# EAGLE design ParaBeep V0.35 (EAGLE 9.6.2)
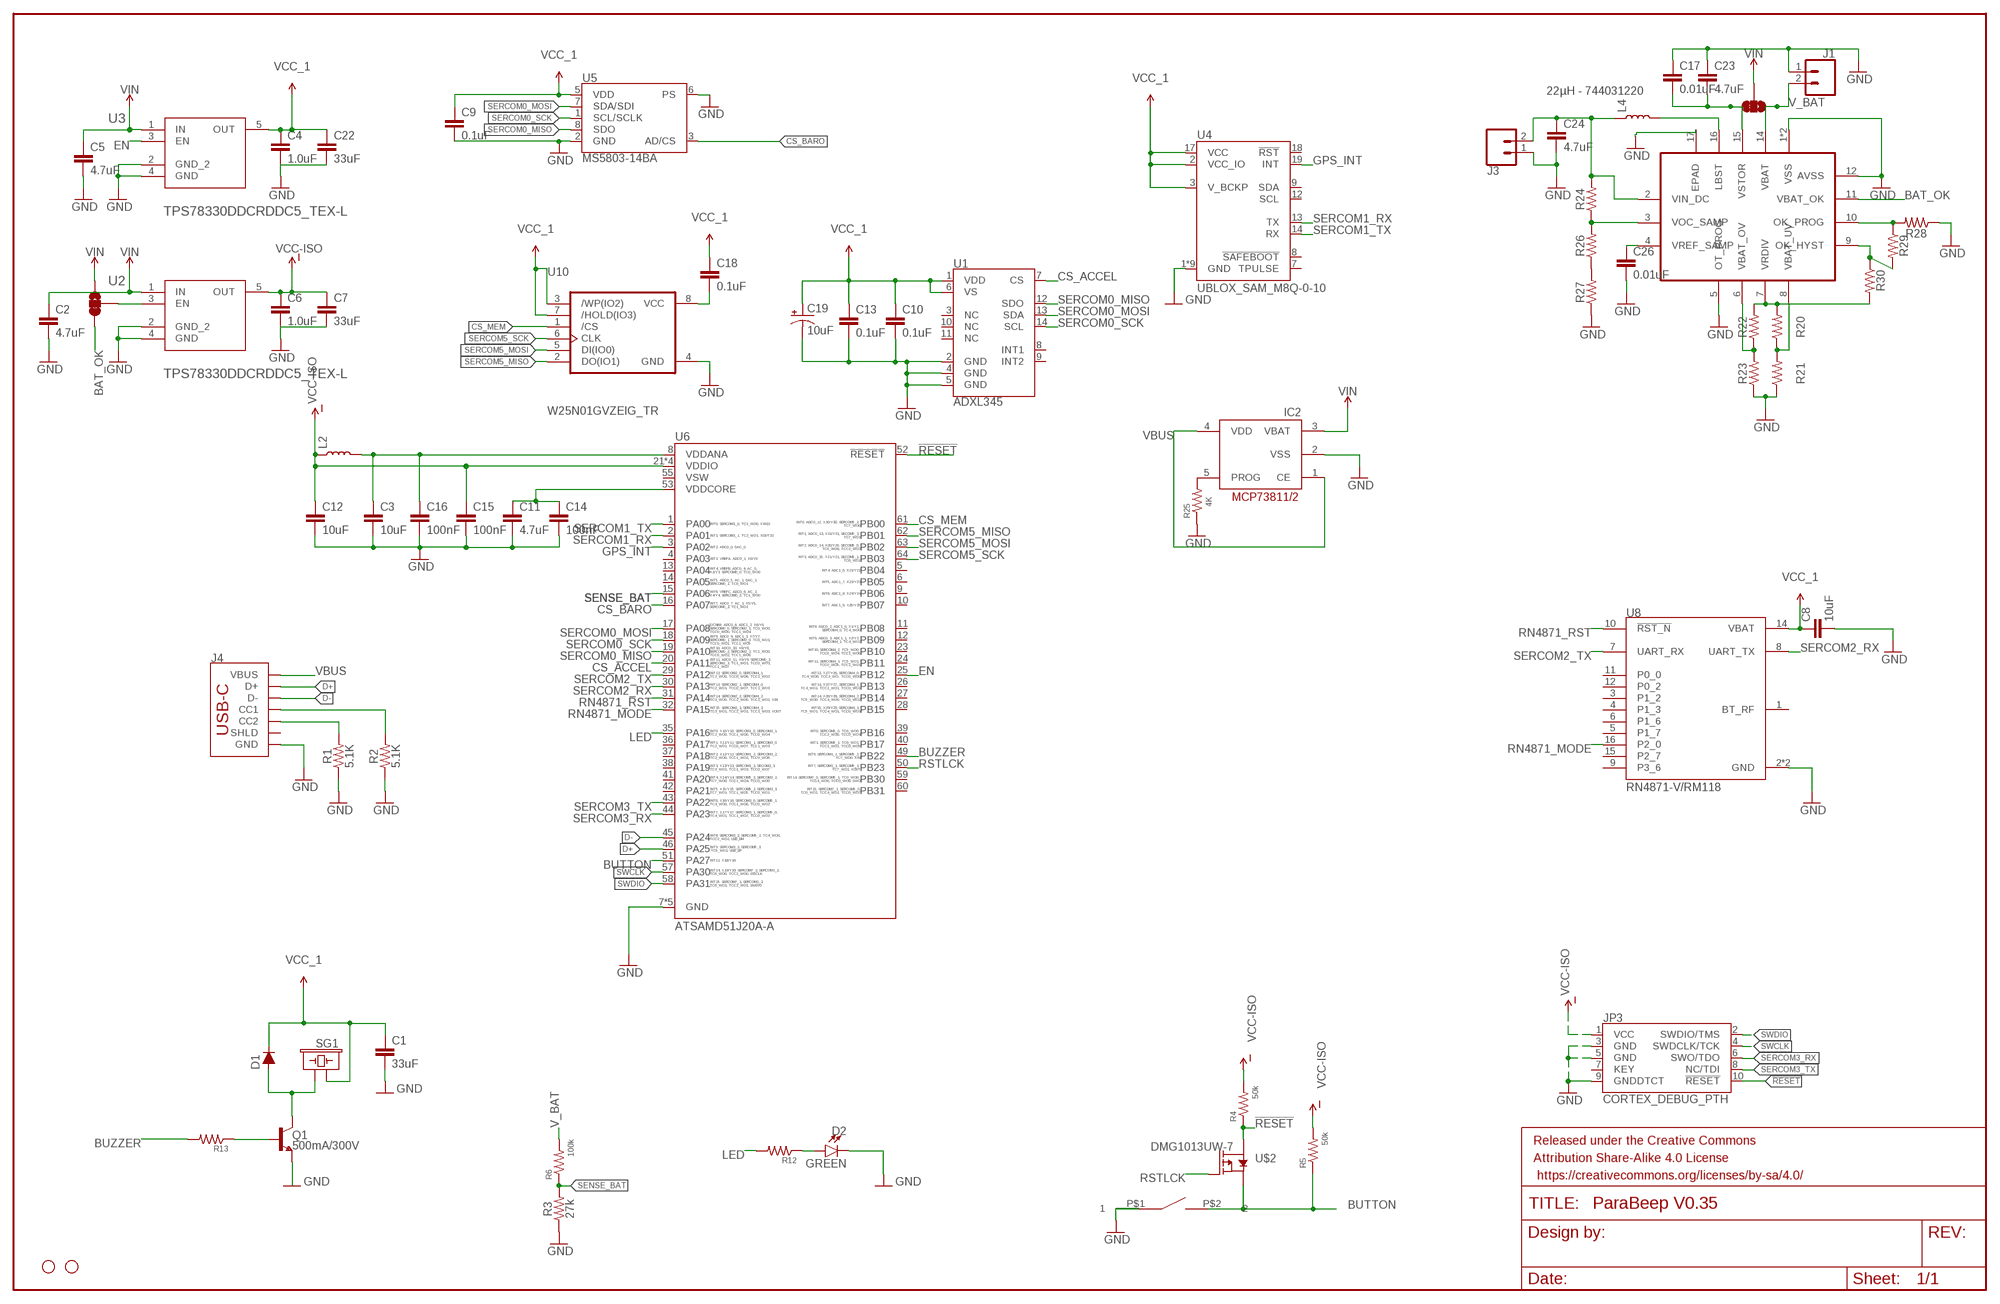
[diagram p0: schematic, sheet 1]

## Parts
C1  33uF  CAP-1206  [1206]
C2  4.7uF  1.0UF-0603-16V-10%  [0603]
C3  10uF  1.0UF-0603-16V-10%  [0603]
C4  1.0uF  1.0UF-0603-16V-10%  [0603]
C5  4.7uF  1.0UF-0603-16V-10%  [0603]
C6  1.0uF  1.0UF-0603-16V-10%  [0603]
C7  33uF  CAP-1206  [1206]
C8  10uF  0.1UF-0603-25V-(+80/-20%)  [0603]
C9  0.1uF  0.1UF-0603-25V-(+80/-20%)  [0603]
C10  0.1uF  0.1UF-0603-25V-(+80/-20%)  [0603]
C11  4.7uF  0.1UF-0603-25V-(+80/-20%)  [0603]
C12  10uF  0.1UF-0603-25V-(+80/-20%)  [0603]
C13  0.1uF  0.1UF-0603-25V-(+80/-20%)  [0603]
C14  100nF  0.1UF-0603-25V-(+80/-20%)  [0603]
C15  100nF  0.1UF-0603-25V-(+80/-20%)  [0603]
C16  100nF  0.1UF-0603-25V-(+80/-20%)  [0603]
C17  0.01uF  CAP-0402  [0402]
C18  0.1uF  0.1UF-0603-25V-(+80/-20%)  [0603]
C19  10uF  10UF-POLAR-EIA3216-16V-10%(TANT)  [EIA3216]
C22  33uF  CAP-1206  [1206]
C23  4.7uF  CAP-0402  [0402]
C24  4.7uF  4.7UF-0603-6.3V-(10%)  [0603]
C26  0.01uF  CAP-0402  [0402]
D1  250mA/100V  DIODE-BAS16J  [SOD-323]
D2  GREEN  LED-GREEN0603  [LED-0603]
FRAME1  FRAME-LEDGER  [CREATIVE_COMMONS]
H1  STAND-OFFTIGHT  [STAND-OFF-TIGHT]
H2  STAND-OFFTIGHT  [STAND-OFF-TIGHT]
IC2  MCP73811/2  [SOT23-5L]
J1  CONN_02-JST-2MM-SMT  [JST-2-SMD]
J3  CONN_02-JST-2MM-SMT  [JST-2-SMD]
J4  USB_C_2-LAYER_PADS  [USB-C-16P-2LAYER-PADS]
JP1  JUMPER-SMT_3_1-NC_TRACE_SILK  [SMT-JUMPER_3_1-NC_TRACE_SILK]
JP2  JUMPER-SMT_3_1-NC_TRACE_SILK  [SMT-JUMPER_3_1-NC_TRACE_SILK]
JP3  CORTEX_DEBUG_PTH  [2X5-PTH-1.27MM]
L2  INDUCTORFB-30OHM  [0603]
L4  22µH - 744031220  INDUCTOR-CDRH-4.7UH  [INDUCTOR_4.7UH]
Q1  500mA/300V  TRANS_NPN-MMBTA42  [SOT23-3]
R1  5.1K  RESISTOR0402  [0402]
R2  5.1K  RESISTOR0402  [0402]
R3  27k  RESISTOR0402  [0402]
R4  50k  RESISTOR0402  [0402]
R5  50k  RESISTOR0402  [0402]
R6  100k  RESISTOR0402  [0402]
R12  RESISTOR0402  [0402]
R13  RESISTOR0402  [0402]
R20  RESISTOR0402  [0402]
R21  RESISTOR0402  [0402]
R22  RESISTOR0402  [0402]
R23  RESISTOR0402  [0402]
R24  RESISTOR0402  [0402]
R25  4K  RESISTOR0402  [0402]
R26  RESISTOR0402  [0402]
R27  RESISTOR0402  [0402]
R28  RESISTOR0402  [0402]
R29  RESISTOR0402  [0402]
R30  RESISTOR0402  [0402]
SG1  BUZZER-SMD_KIT  [BUZZER-CCV-KIT]
U1  ADXL345  [LGA-14]
U2  TPS78330DDCRDDC5_TEX-L  [DDC5_TEX-L]
U3  TPS78330DDCRDDC5_TEX-L  [DDC5_TEX-L]
U4  UBLOX_SAM_M8Q-0-10  [SAM-M8Q]
U5  MS5803-14BA  [MS5803]
U6  ATSAMD51J20A-A  [TQFP64]
U8  RN4871-V/RM118  [XCVR_RN4871-V/RM118]
U9  BQ25504RGTR  [QFN50P300X300X100-17N]
U10  W25N01GVZEIG_TR  [SON127P800X600X80-9N]
U$2  DMG1013UW-7  [DMG1013UW-7]
U$3  AB11AH-HC  [AB11AH-HC]

## Nets
!RESET: JP3.10(!RESET) R4.1 U6.52(!RESET) U$2.2(S)
BAT_OK: JP2.3 U9.11(VBAT_OK)
BUTTON: R5.1 U6.51(PA27) U$2.3(D) U$3.P$2
BUZZER: R13.2 U6.49(PB22)
CS_ACCEL: U1.7(CS) U6.20(PA11)
CS_BARO: U5.3(AD/CS) U6.16(PA07)
CS_MEM: U6.61(PB00) U10.1(/CS)
D+: J4.A6(D+) J4.B6(D+) U6.46(PA25)
D-: J4.A7(D-) J4.B7(D-) U6.45(PA24)
EN: U3.3(EN) U6.25(PB12)
GND: C1.2 C2.2 C3.2 C4.2 C5.2 C6.2 C7.2 C8.2 C9.2 C10.2 C11.2 C12.2 C13.2 C14.2 C15.2 C16.2 C17.1 C19.- C22.2 C23.1 C24.2 C26.2 D2.C IC2.2(VSS) J1.1 J3.1 J4.GND J4.GND2(GND) JP3.3(GND) JP3.5(GND) JP3.9(GNDDTCT) Q1.2(E) R1.1 R2.1 R3.1 R21.1 R23.1 R25.1 R27.1 R28.1 U1.2(GND) U1.4(GND) U1.5(GND) U2.2(GND_2) U2.4(GND) U3.2(GND_2) U3.4(GND) U4.1(GND) U4.4(GND) U4.5(GND) U4.6(GND) U4.10(GND) U4.11(GND) U4.15(GND) U4.16(GND) U4.20(GND) U5.2(GND) U5.6(PS) U6.7(GND) U6.22(GND) U6.33(GND) U6.47(GND) U6.54(GND) U8.2(GND) U8.13(GND) U9.1(VSS) U9.5(OT_PROG) U9.12(AVSS) U9.13(VSS) U9.17(EPAD) U10.4(GND) U$3.P$1
GPS_INT: U4.19(INT) U6.3(PA02)
LED: R12.2 U6.35(PA16)
N$1: R20.2 R22.2 R30.2 U9.7(VRDIV)
N$2: R20.1 R21.2 U9.8(VBAT_UV)
N$3: C17.2 C23.2 JP1.3 U9.15(VSTOR)
N$4: J4.B5(CC2) R1.2
N$5: J4.A5(CC1) R2.2
N$6: JP2.2 U2.3(EN)
N$10: D1.A Q1.3(C) SG1.-
N$13: Q1.1(B) R13.1
N$14: C18.2 U10.8(VCC)
N$17: D2.A R12.1
N$18: IC2.5(PROG) R25.2
N$19: C11.1 C14.1 U6.53(VDDCORE)
N$20: R22.1 R23.2 U9.6(VBAT_OV)
N$21: R29.2 R30.1 U9.9(OK_HYST)
N$22: R28.2 R29.1 U9.10(OK_PROG)
N$23: C3.1 C16.1 L2.2 U6.8(VDDANA)
N$24: C26.1 U9.4(VREF_SAMP)
N$25: R24.1 R26.2 U9.3(VOC_SAMP)
N$26: C24.1 J3.2 L4.P$1 R24.2 U9.2(VIN_DC)
N$27: L4.P$2 U9.16(LBST)
N$29: R26.1 R27.2
RN4871_MODE: U6.32(PA15) U8.16(P2_0)
RN4871_RST: U6.31(PA14) U8.10(!RST_N)
RSTLCK: U6.50(PB23) U$2.1(G)
SENSE_BAT: R3.2 R6.1 U6.15(PA06)
SERCOM0_MISO: U1.12(SDO) U5.8(SDO) U6.19(PA10)
SERCOM0_MOSI: U1.13(SDA) U5.7(SDA/SDI) U6.17(PA08)
SERCOM0_SCK: U1.14(SCL) U5.1(SCL/SCLK) U6.18(PA09)
SERCOM1_RX: U4.13(TX) U6.2(PA01)
SERCOM1_TX: U4.14(RX) U6.1(PA00)
SERCOM2_RX: U6.30(PA13) U8.8(UART_TX)
SERCOM2_TX: U6.29(PA12) U8.7(UART_RX)
SERCOM3_RX: JP3.6(SWO/TDO) U6.44(PA23)
SERCOM3_TX: JP3.8(NC/TDI) U6.43(PA22)
SERCOM5_MISO: U6.62(PB01) U10.2(DO(IO1))
SERCOM5_MOSI: U6.63(PB02) U10.5(DI(IO0))
SERCOM5_SCK: U6.64(PB03) U10.6(CLK)
SWCLK: JP3.4(SWDCLK/TCK) U6.57(PA30)
SWDIO: JP3.2(SWDIO/TMS) U6.58(PA31)
V_BAT: J1.2 JP1.1 R6.2 U9.14(VBAT)
VBUS: IC2.1(CE) IC2.4(VDD) J4.VBUS1(VBUS) J4.VBUS2(VBUS)
VCC-ISO: C6.1 C7.1 C12.1 C15.1 JP3.1(VCC) L2.1 R4.2 R5.2 U2.5(OUT) U6.21(VDDIO) U6.34(VDDIO) U6.48(VDDIO) U6.56(VDDIO)
VCC_1: C1.1 C4.1 C8.1 C9.1 C10.1 C13.1 C18.1 C19.+ C22.1 D1.C SG1.+ U1.1(VDD) U1.6(VS) U3.5(OUT) U4.2(VCC_IO) U4.3(V_BCKP) U4.17(VCC) U5.5(VDD) U8.14(VBAT) U10.3(/WP(IO2)) U10.7(/HOLD(IO3))
VIN: C2.1 C5.1 IC2.3(VBAT) JP1.2 JP2.1 U2.1(IN) U3.1(IN)
Unconnected: J4.SHLD1(SHLD) J4.SHLD2(SHLD) J4.SHLD3(SHLD) J4.SHLD4(SHLD) JP3.7(KEY) U1.3(NC) U1.8(INT1) U1.9(INT2) U1.10(NC) U1.11(NC) U4.7(TPULSE) U4.8(!SAFEBOOT) U4.9(SDA) U4.12(SCL) U4.18(!RST) U6.4(PA03) U6.5(PB04) U6.6(PB05) U6.9(PB06) U6.10(PB07) U6.11(PB08) U6.12(PB09) U6.13(PA04) U6.14(PA05) U6.23(PB10) U6.24(PB11) U6.26(PB13) U6.27(PB14) U6.28(PB15) U6.36(PA17) U6.37(PA18) U6.38(PA19) U6.39(PB16) U6.40(PB17) U6.41(PA20) U6.42(PA21) U6.55(VSW) U6.59(PB30) U6.60(PB31) U8.1(BT_RF) U8.3(P1_2) U8.4(P1_3) U8.5(P1_7) U8.6(P1_6) U8.9(P3_6) U8.11(P0_0) U8.12(P0_2) U8.15(P2_7)

## Library data of the parts
C1 C7 C17 C22 C23 C26 = SparkFun-Capacitors:CAP
C2 C3 C5 = SparkFun-Capacitors:1.0UF: 1µF ceramic capacitors A capacitor is a passive two-terminal electrical component used to store electrical energy temporarily in an electric field.; PROD_ID: CAP-00868; VALUE: 1.0uF
C4 C6 = SparkFun-Capacitors:1.0UF: 1µF ceramic capacitors A capacitor is a passive two-terminal electrical component used to store electrical energy temporarily in an electric field.; PROD_ID: CAP-00868
C8 C11 C12 C14-C16 = SparkFun-Capacitors:0.1UF: 0.1µF ceramic capacitors A capacitor is a passive two-terminal electrical component used to store electrical energy temporarily in an electric field.; PROD_ID: CAP-00810; VALUE: 0.1uF
C9 C10 C13 C18 = SparkFun-Capacitors:0.1UF: 0.1µF ceramic capacitors A capacitor is a passive two-terminal electrical component used to store electrical energy temporarily in an electric field.; PROD_ID: CAP-00810
C19 = SparkFun-Capacitors:10UF-POLAR: 10.0µF polarized capacitors A capacitor is a passive two-terminal electrical component used to store electrical energy temporarily in an electric field.; PROD_ID: CAP-00811
C24 = SparkFun-Capacitors:4.7UF: 4.7µF ceramic capacitors A capacitor is a passive two-terminal electrical component used to store electrical energy temporarily in an electric field.; PROD_ID: CAP-08280
D1 = SparkFun-DiscreteSemi:DIODE: Diode These are standard reverse protection diodes and small signal diodes. SparkFun Products: SparkFun SparkPunk Sound Kit <https://www.sparkfun.com/products/11177> SparkFun ESP8266 Thing <https://www.sparkfun.com/products/13231>; PROD_ID: DIO-09646
D2 = SparkFun-LED:LED-GREEN: Green SMD LED Used in manufacturing of various products at SparkFun Packages: 0603 - SMD 0603 package [Product Link] <http://www.futureelectronics.com/en/technologies/semiconductors/optoelectronics/leds/Pages/9894312-LTST-C190GKT.aspx?CrossPart=HSMG-C190&IM=0> LilyPad 1206 - SMD1206 LilyPad package [Product Link] <http://www.futureelectronics.com/en/Technologies/Product.aspx?ProductID=IN150NGHARVATEKCORPORATION2049943&IM=0> 1206 - SMD1206 package [Product Link] <http://www.futureelectronics.com/en/technologies/semiconductors/optoelectronics/leds/Pages/8315665-LTST-C150KGKT.aspx?IM=0> 1206 Bottom Mount -SMD 1206 Bottom Mount [Product Link] <http://www.digikey.com/product-detail/en/lite-on-inc/LTST-C230KGKT/160-1456-1-ND/386854> SparkFun Products: Pro Mini 328 -5V <https://www.sparkfun.com/products/821> RedBoard <https://www.sparkfun.com/products/12757> MP3 Trigger <https://www.sparkfun.com/products/13720> Makey Makey <https://www.sparkfun.com/products/11076>; PROD_ID: DIO-00821
FRAME1 = SparkFun-Aesthetics:FRAME-LEDGER: Schematic Frame - Ledger Standard 11x14 US Ledger frame
H1 H2 = SparkFun-Hardware:STAND-OFF: Stand Off Drill holes for mechanically mounting via screws, standoffs, etc. Note: Use the keepout ring to avoid running the screw head into surrounding components. Variant Overviews STAND-OFF - Mechanical footprint for a #4 phillips button head screw. STAND-OFF-TIGHT - Mechanical footprint for a #4 phillips button head screw, Example SparkFun Products Screw - Phillips Head (1/4", 4-40, 10 pack) <https://www.sparkfun.com/products/10453> (PRT-10453) Screw - Phillips Head (1/2", 4-40, 10 pack) <https://www.sparkfun.com/products/10452> (PRT-10452) Screw - Phillips Head (3/4", 4-40, 10 pack) <https://www.sparkfun.com/products/10451> (PRT-10451) Screw - Phillips Head (1", 4-40, 10 pack) <https://www.sparkfun.com/products/10450> (PRT-10450)
IC2 = adafruit:MCP73811/2: MCP73811 and MCP73812 Simple, Miniature Single-Cell, Fully Integrated Li-Ion / Li-Polymer Charge Management Controllers SOT-23-5 package, no indicator LED but with adjustable current, small and very inexpensive
J1 J3 = SparkFun-Connectors:CONN_02: Multi connection point. Often used as Generic Header-pin footprint for 0.1 inch spaced/style header connections On any of the 0.1 inch spaced packages, you can populate with these: Break Away Headers - Straight <https://www.sparkfun.com/products/116> (PRT-00116) Break Away Male Headers - Right Angle <https://www.sparkfun.com/products/553> (PRT-00553) Female Headers <https://www.sparkfun.com/products/115> (PRT-00115) Break Away Headers - Machine Pin <https://www.sparkfun.com/products/117> (PRT-00117) Break Away Female Headers - Swiss Machine Pin <https://www.sparkfun.com/products/743> (PRT-00743) For SCREWTERMINALS and SPRING TERMINALS visit here: Screw Terimnals on SparkFun.com <https://www.sparkfun.com/search/results?term=Screw+Terminals> (5mm/3.5mm/2.54mm spacing) This device is also useful as a general connection point to wire up your design to another part of your project. Our various solder wires solder well into these plated through hole pads. Hook-Up Wire - Assortment (Stranded, 22 AWG) <https://www.sparkfun.com/products/11375> (PRT-11375) Hook-Up Wire - Assortment (Solid Core, 22 AWG) <https://www.sparkfun.com/products/11367> (PRT-11367) View the entire wire category on our website here <https://www.sparkfun.com/categories/141> Special notes: Molex polarized connector foot print use with: PRT-08233 with associated crimp pins and housings. 2.54_SCREWTERM for use with PRT-10571. 3.5mm Screw Terminal footprints for PRT-08084 5mm Screw Terminal footprints for use with PRT-08432; PROD_ID: CONN-11443
J4 = SparkFun-Connectors:USB_C: USB Type C 16Pin Connector Super Speed pins not available on the 16-pin purely SMD connector so this part is best for USB 2.0 implementations. D1 and D2 are tied together enabling D+/- no matter which way the cable is plugged into the connector. The two channel configuration pins (CC1/2) are exposed. These are normally connected to ground via 5.1k resistors but can be reconfigured for high current/high power applications. **4-LAYER BOARD WARNING!!** If designing 4-layer board, make sure to select the variant _4-LAYER-ISOLATED. The linked footprint (USB-C-16-4LAYER-ISOLATED) includes some very necessary cutout polygons in the inner layers (2 and 15). This prevents the PTH mounting shield legs on the USB connector from electrically connecting any other polygons on the inner layers (usually VCC and GND).; PROD_ID: CONN-14122
JP1 JP2 = SparkFun-Jumpers:JUMPER-SMT_3_1-NC_TRACE: Normally closed trace jumper (1 of 2 connections) This jumper has a trace between two pads so it's normally closed (NC). The other connection is normally open (NO). Use a razor knife to open the connection. For best results follow the IPC guidelines for cutting traces: Cutout at least 0.063 mm (0.005 in). Remove all loose material to clean up the cut area. Seal the cut with an approved epoxy. Reapply solder to reclose the connection, or to close the NO connection.
JP3 = SparkFun-Connectors:CORTEX_DEBUG: Cortex Debug Connector - 10 pin Supports JTAG debug, Serial Wire debug, and Serial Wire Viewer. PTH and SMD connector options available. General Connector Information <http://infocenter.arm.com/help/topic/com.arm.doc.faqs/attached/13634/cortex_debug_connectors.pdf> Products: PTH Connector <http://www.digikey.com/product-detail/en/cnc-tech/3220-10-0100-00/1175-1627-ND/3883661> -via Digi-Key SparkFun PSoc <https://www.sparkfun.com/products/13229> SparkFun T <https://www.sparkfun.com/products/13810>
L2 = SparkFun-Coils:INDUCTOR: Inductors Resist changes in electrical current. Basically a coil of wire. SparkFun Products: SparkFun Load Cell Amplifier - HX711 <https://www.sparkfun.com/products/13879> IOIO-OTG - V2.2 <https://www.sparkfun.com/products/13613>; PROD_ID: NDUC-07859
L4 = SparkFun-Coils:INDUCTOR: Inductors Resist changes in electrical current. Basically a coil of wire. SparkFun Products: SparkFun Load Cell Amplifier - HX711 <https://www.sparkfun.com/products/13879> IOIO-OTG - V2.2 <https://www.sparkfun.com/products/13613>; PROD_ID: NDUC-10146; VALUE: 4.7µH/±30%/1.2A
Q1 = SparkFun-DiscreteSemi:TRANS_NPN: NPN transistor Current controlled devices typically used to amplify current or used as a switch. BC547 - COM-08928 <http://www.sparkfun.com/products/8928> (TO-92 45V 100mA) (1.Collector 2.Base 3.Emitter) 2N3904 - COM-00521 <http://www.sparkfun.com/products/521> (TO-92 40V 200mA) (1.Emitter 2.Base 3.Collector) P2N2222A - COM-12852 <http://www.sparkfun.com/products/12852> (TO-92 40V 600mA) (1.Collector 2.Base 3.Emitter); PROD_ID: TRANS-09116
R1-R6 R12 R13 R20-R30 = SparkFun-Resistors:RESISTOR: Generic Resistor Package
SG1 = SparkFun-Electromechanical:BUZZER: Buzzer Small round buzzers that operate around the audible 2kHz range. You can use these as speakers to create simple music or user interfaces. Variant Overview: PTH - Mini Speaker - PC Mount 12mm 2.048kHz <https://www.sparkfun.com/products/7950> PTH_KIT - Mini Speaker - PC Mount 12mm 2.048kHz <https://www.sparkfun.com/products/7950> KIT simplifies soldering by adding stop mask to one side of the pads. PTH_NO_SILK - Mini Speaker - PC Mount 12mm 2.048kHz <https://www.sparkfun.com/products/7950> No silkscreen indicator of buzzer outline. PTH_KIT_NO_SILK - Mini Speaker - PC Mount 12mm 2.048kHz <https://www.sparkfun.com/products/7950> KIT package w/o silkscreen SMD - Buzzer Audio Magnetic (CCV-084B16) SMD buzzer used on, e.g. the LilyPad Buzzer <https://www.sparkfun.com/products/8463> and RFID USB Reader <https://www.sparkfun.com/products/9963>. SMD_KIT - Buzzer Audio Magnetic (CCV-084B16) SMD Buzzer with elongated pins to make soldering easier. Used on the SparkFun Simon Says - Surface Mount Soldering Kit <https://www.sparkfun.com/products/10935>.; PROD_ID: COMP-08568
U1 = SparkFun-Sensors:ADXL345: Analog Devices ADXL345 3-Axis SPI/I2C 2/4/8/16g Accelerometer The ADXL345 is a small, thin, low power, 3-axis accelerometer with high resolution (13-bit) measurement at up to ±16g. Digital output data is formatted as 16-bit twos complement and is accessible through either a SPI (3- or 4-wire) or I2C digital interface. Datasheet <https://www.sparkfun.com/datasheets/Sensors/Accelerometer/ADXL345.pdf> SparkFun Products SparkFun Triple Axis Accelerometer Breakout - ADXL345 <https://www.sparkfun.com/products/9836> (SEN-09836) Triple Axis Accelerometer - ADXL345 <https://www.sparkfun.com/products/9045> (SEN-09045) SparkFun 6 Degrees of Freedom IMU Digital Combo Board - ITG3200/ADXL345 <https://www.sparkfun.com/products/10121> (SEN-10121); PROD_ID: IC-09097; SF_ID: SEN-09045
U2 U3 = TPS78330DDCR:TPS78330DDCR; BUILT_BY: EMA_UL_Team; MANUFACTURER: Texas Instruments; MANUFACTURER_PART_NUMBER: TPS78330DDCR; SOURCELIBRARY: TI_2014-06-19; VENDOR: Texas Instruments
U4 = SparkFun-GPS:UBLOX_SAM_M8Q-0-10: u-blox SAM-M8Q The u-blox concurrent SAM-M8Q GNSS patch antenna module benefits from the exceptional performance of the u-blox M8 multi-GNSS engine. The SAM-M8Q module offers high sensitivity and minimal acquisition times in an ultra compact form factor. The SAM-M8Q module utilizes concurrent reception of up to three GNSS systems (GPS/Galileo and GLONASS), recognizes multiple constellations simultaneously and provides outstanding positioning accuracy in scenarios where urban canyon or weak signals are involved. For even better and faster positioning improvement, the SAM-M8Q supports augmentation of QZSS, GAGAN and IMES together with WAAS, EGNOS, MSAS. The SAM-M8Q also supports message integrity protection, geofencing, and spoofing detection with configurable interface settings to easily fit to customer applications.; PROD_ID: IC-14070
U5 = SparkFun-Sensors:MS5803-14BA: Measurement Specialties MS5803_14BA Pressure (Depth) Sensor The MS5803-14BA is a new generation of high resolution pressure sensors with SPI and I2C bus interface. It is optimized for depth measurement systems with a water depth resolution of 1cm and below. The sensor module includes a high linear pressure sensor and an ultra low power 24 bit ΔΣ ADC with internal factory calibrated coefficients. It provides a precise digital 24 Bit pressure and temperature value and different operation modes that allow the user to optimize for conversion speed and current consumption. Datasheet <https://cdn.sparkfun.com/datasheets/Sensors/Weather/ms5803_14ba.pdf> SparkFun Products SparkFun Pressure Sensor Breakout - MS5803-14BA <https://www.sparkfun.com/products/12909> (SEN-12909); PROD_ID: IC-12111
U6 = SparkFun-IC-Microcontroller:ATSAMD51J20A-A; PROD_ID: IC-13952
U8 = RN4871-V_RM118:RN4871-V/RM118: Bluetooth 4.2 BLE Module Shielded Antenna ASCII Interface 9x11.5mm; DESCRIPTION: Bluetooth Bluetooth v5.0 Transceiver Module 2.4GHz Integrated, Chip Surface Mount; DIGI-KEY_PART_NUMBER: RN4871-V/RM118-ND; MF: Microchip; MP: RN4871-V/RM118; PACKAGE: SMD-16 Microchip; PURCHASE-URL: https://pricing.snapeda.com/search/part/RN4871-V/RM118/?ref=eda
U9 = BQ25504RGTR:BQ25504RGTR; DESCRIPTION: Ultra Low Power Boost Converter with Battery Management for Energy Harvester | Nano-Power Management 16-VQFN -40 to 85; DIGI-KEY_PART_NUMBER: 296-48495-1-ND; MF: Texas Instruments; MP: BQ25504RGTR; PACKAGE: VQFN-16 Texas Instruments; PURCHASE-URL: https://pricing.snapeda.com/search/part/BQ25504RGTR/?ref=eda
U10 = W25N01GVZEIG_TR:W25N01GVZEIG_TR: Ic Flash 1gbit 104mhz 8wson Check prices <https://pricing.snapeda.com/parts/W25N01GVZEIG%20TR/Winbond%20Electronics/view-part?ref=eda>; AVAILABILITY: Good; DESCRIPTION: FLASH - NAND Memory IC 1Gb (128M x 8) SPI 104MHz 8-WSON (8x6); MF: Winbond Electronics; MP: W25N01GVZEIG TR; PACKAGE: WSON-8 Winbond; PRICE: None; PURCHASE-URL: https://pricing.snapeda.com/search/part/W25N01GVZEIG TR/?ref=eda
U$2 = DMG1013UW-7:DMG1013UW-7
U$3 = AB11AH-HC:AB11AH-HC

## Board
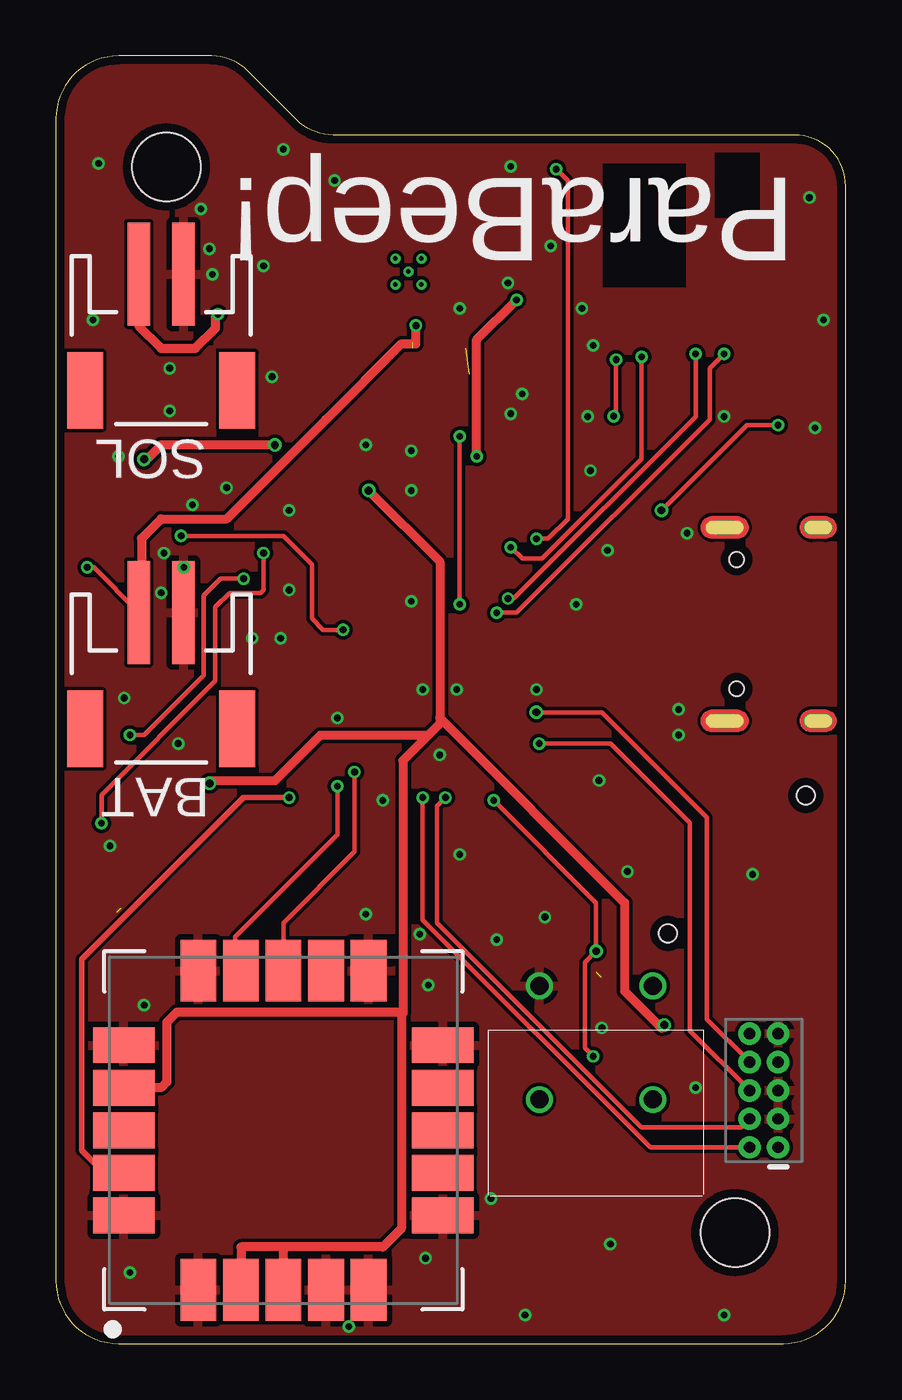
[diagram p1: board, top side]
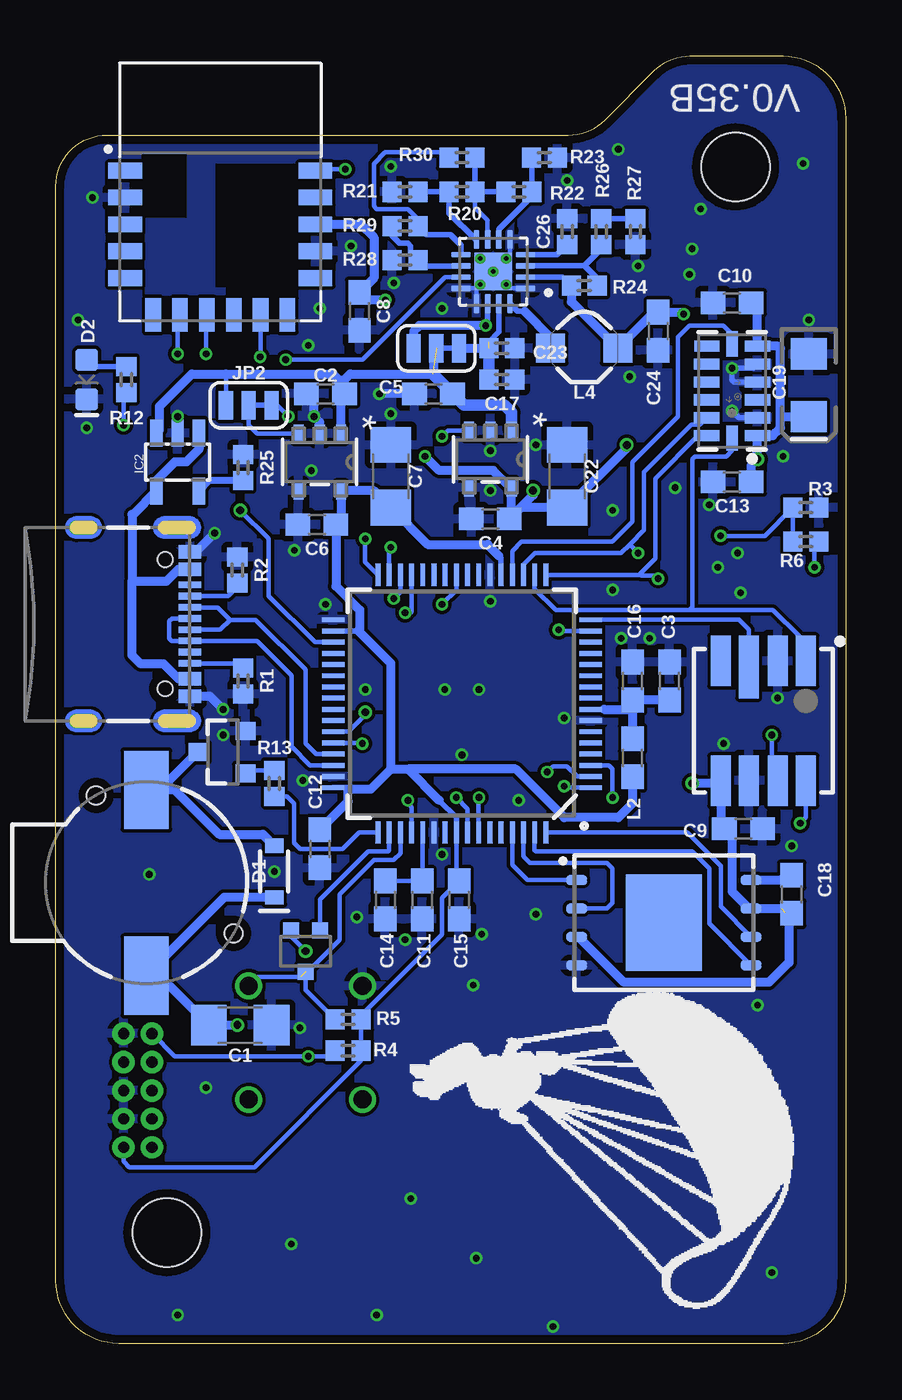
[diagram p2: board, bottom side, seen from below]

Size 35.28 x 57.51 mm. Coordinates in mm from the lower left corner, seen from the top.
Outline: 0,54.71 0,2.79 arc90 2.79,0 32.49,0 arc90 35.28,2.79 35.28,51.69 arc90 32.99,53.98 12.38,53.98 arc-45 10.76,54.65 8.57,56.84 arc45 6.95,57.51 2.79,57.51 arc90 0,54.71
Copper layers (1*16): Top 0.035559375mm / dielectric 1.6mm / Bottom 0.035559375mm
Design rules "oshpark-2layer *": minimum track width 6mil, minimum drill 10mil, track to track 6mil, track to pad 6mil, pad to pad 6mil, via to via 6mil, smd to smd 6mil, copper to edge 15mil, drill to drill 6mil, minimum pad ring 5mil, minimum via ring 5mil, stop-mask expansion 0mil, vias tented up to drill 50mil, thermal gap 10mil

### Footprints (pad centres in the part's own frame; a part is rotated, then mirrored left to right if it is on the bottom)
1206 = smd 1.6 x 1.8: 1 -1.4,0; 2 1.4,0
0603 = smd 1.1 x 1: 1 -0.85,0; 2 0.85,0
0402 = smd 0.85 x 0.9: 1 -0.58,0; 2 0.58,0
EIA3216 = smd 1.4 x 1.6: + 1.4,0; - -1.4,0
SOD-323 = smd 0.63 x 0.83: A 1.15,0; C -1.15,0
LED-0603 = smd 1 x 1: A -0.877,0; C 0.877,0
STAND-OFF-TIGHT = hole 3.048: 0,0
SOT23-5L = smd 0.55 x 1.2: 1 -0.95,-1.3; 2 0,-1.3; 3 0.95,-1.3; 4 0.95,1.3; 5 -0.95,1.3
JST-2-SMD = smd 1 x 4.6: 1 -1,-3.7; 2 1,-3.7 | smd 1.6 x 3.4: NC1 -3.4,1.5; NC2 3.4,1.5
USB-C-16P-2LAYER-PADS = smd 0.3 x 1: A5 -1.25,-0.34; A6 -0.25,-0.34; A7 0.25,-0.34; A8 1.25,-0.34; B5 1.75,-0.34; B6 0.75,-0.34; B7 -0.75,-0.34; B8 -1.75,-0.34 | smd 0.6 x 1: GND -3.225,-0.34; GND2 3.225,-0.34; VBUS1 -2.45,-0.34; VBUS2 2.45,-0.34 | drill 0.4 pad 0.6 long: SHLD1 -4.318,-0.915; SHLD2 4.318,-0.915; SHLD3 -4.318,-5.095; SHLD4 4.318,-5.095 | hole 0.65: -2.89,-1.445; 2.89,-1.445
SMT-JUMPER_3_1-NC_TRACE_SILK = smd 0.635 x 1.27: 1 -1.016,0; 2 0,0; 3 1.016,0
2X5-PTH-1.27MM = drill 0.508 pad 1: 1 -2.54,-0.635; 2 -2.54,0.635; 3 -1.27,-0.635; 4 -1.27,0.635; 5 0,-0.635; 6 0,0.635; 7 1.27,-0.635; 8 1.27,0.635; 9 2.54,-0.635; 10 2.54,0.635
INDUCTOR_4.7UH = smd 1.3 x 1.3: P$1 -1.5,0; P$2 1.5,0
SOT23-3 = smd 0.8 x 0.9: 1 -0.95,-1; 2 0.95,-1; 3 0,1.1
BUZZER-CCV-KIT = smd 3.5 x 2: + 4.15,0; - -4.15,0 | hole 0.8: -3.9,-2.25; 2.25,3.9
LGA-14 = smd 0.5 x 1.124: 1 2,1.138; 2 1.2,1.138; 3 0.4,1.138; 4 -0.4,1.138; 5 -1.2,1.138; 6 -2,1.138; 8 -2,-1.13; 9 -1.2,-1.138; 10 -0.4,-1.138; 11 0.4,-1.138; 12 1.2,-1.138; 13 2,-1.138 | smd 1.124 x 0.5: 7 -2.1,0; 14 2.1,0
DDC5_TEX-L = smd 0.8 x 0.457: 1 -1.276,0.95; 2 -1.276,0; 3 -1.276,-0.95; 4 1.276,-0.95; 5 1.276,0.95
SAM-M8Q = smd 2.75 x 1.6: 1 -7.125,3.8; 2 -7.125,1.9; 3 -7.125,0; 4 -7.125,-1.9; 5 -7.125,-3.8; 11 7.125,-3.8; 12 7.125,-1.9; 13 7.125,0; 14 7.125,1.9; 15 7.125,3.8 | smd 1.6 x 2.75: 6 -3.8,-7.125; 7 -1.9,-7.125; 8 0,-7.125; 9 1.9,-7.125; 10 3.8,-7.125; 16 3.8,7.125; 17 1.9,7.125; 18 0,7.125; 19 -1.9,7.125; 20 -3.8,7.125
MS5803 = smd 2.25 x 0.9: 1 -2.675,1.9; 2 -2.675,0.65; 4 -2.675,-1.9; 5 2.675,-1.9; 6 2.675,-0.65; 7 2.675,0.65; 8 2.675,1.9 | smd 2.8 x 0.9: 3 -2.4,-0.65
TQFP64 = smd 0.22 x 1: 1 -3.75,-5.75; 2 -3.25,-5.75; 3 -2.75,-5.75; 4 -2.25,-5.75; 5 -1.75,-5.75; 6 -1.25,-5.75; 7 -0.75,-5.75; 8 -0.25,-5.75; 9 0.25,-5.75; 10 0.75,-5.75; 11 1.25,-5.75; 12 1.75,-5.75; 13 2.25,-5.75; 14 2.75,-5.75; 15 3.25,-5.75; 16 3.75,-5.75; 33 3.75,5.75; 34 3.25,5.75; 35 2.75,5.75; 36 2.25,5.75; 37 1.75,5.75; 38 1.25,5.75; 39 0.75,5.75; 40 0.25,5.75; 41 -0.25,5.75; 42 -0.75,5.75; 43 -1.25,5.75; 44 -1.75,5.75; 45 -2.25,5.75; 46 -2.75,5.75; 47 -3.25,5.75; 48 -3.75,5.75 | smd 1 x 0.22: 17 5.75,-3.75; 18 5.75,-3.25; 19 5.75,-2.75; 20 5.75,-2.25; 21 5.75,-1.75; 22 5.75,-1.25; 23 5.75,-0.75; 24 5.75,-0.25; 25 5.75,0.25; 26 5.75,0.75; 27 5.75,1.25; 28 5.75,1.75; 29 5.75,2.25; 30 5.75,2.75; 31 5.75,3.25; 32 5.75,3.75; 49 -5.75,3.75; 50 -5.75,3.25; 51 -5.75,2.75; 52 -5.75,2.25; 53 -5.75,1.75; 54 -5.75,1.25; 55 -5.75,0.75; 56 -5.75,0.25; 57 -5.75,-0.25; 58 -5.75,-0.75; 59 -5.75,-1.25; 60 -5.75,-1.75; 61 -5.75,-2.25; 62 -5.75,-2.75; 63 -5.75,-3.25; 64 -5.75,-3.75
XCVR_RN4871-V/RM118 = smd 1.5 x 0.7: 1 -4.25,0.95; 2 -4.25,-0.25; 3 -4.25,-1.45; 4 -4.25,-2.65; 5 -4.25,-3.85; 12 4.25,-3.85; 13 4.25,-2.65; 14 4.25,-1.45; 15 4.25,-0.25; 16 4.25,0.95 | smd 0.7 x 1.5: 6 -3,-5.5; 7 -1.8,-5.5; 8 -0.6,-5.5; 9 0.6,-5.5; 10 1.8,-5.5; 11 3,-5.5
QFN50P300X300X100-17N = smd 0.86 x 0.26: 1 -1.435,0.75; 2 -1.435,0.25; 3 -1.435,-0.25; 4 -1.435,-0.75; 9 1.435,-0.75; 10 1.435,-0.25; 11 1.435,0.25; 12 1.435,0.75 | smd 0.26 x 0.86: 5 -0.75,-1.435; 6 -0.25,-1.435; 7 0.25,-1.435; 8 0.75,-1.435; 13 0.75,1.435; 14 0.25,1.435; 15 -0.25,1.435; 16 -0.75,1.435 | smd 1.68 x 1.68: 17 0,0 | drill 0.2 pad 0.4: 18 0,0; 19 -0.58,0.58; 20 0.58,0.58; 21 -0.58,-0.58; 22 0.58,-0.58
SON127P800X600X80-9N = smd 0.94 x 0.44: 1 -3.895,1.905; 2 -3.895,0.635; 3 -3.895,-0.635; 4 -3.895,-1.905; 5 3.895,-1.905; 6 3.895,-0.635; 7 3.895,0.635; 8 3.895,1.905 | smd 3.4 x 4.3: 9 0,0
DMG1013UW-7 = smd 0.7 x 0.7: 1 -0.65,-0.925; 2 0.65,-0.925; 3 0,0.925
AB11AH-HC = drill 0.8: P$1 -2.54,9.373; P$2 2.54,9.373; P$3 -2.54,4.293; P$4 2.54,4.293

### Placement (x,y rotation side)
C1  27.05,14.22 0 bottom
C2  23.24,42.42 180 bottom
C3  7.87,29.59 90 bottom
C4  15.88,36.83 180 bottom
C5  18.41,42.42 180 bottom
C6  23.62,36.58 180 bottom
C7  20.32,38.73 90 bottom
C8  21.72,46.1 270 bottom
C9  4.57,22.99 0 bottom
C10  5.08,46.48 180 bottom
C11  18.92,19.81 270 bottom
C12  23.5,22.1 270 bottom
C13  5.08,38.48 180 bottom
C14  20.57,19.81 270 bottom
C15  17.27,19.81 270 bottom
C16  9.53,29.59 90 bottom
C17  15.37,43.05 180 bottom
C18  2.41,20.07 90 bottom
C19  1.65,42.8 270 bottom
C22  12.45,38.73 90 bottom
C23  15.37,44.45 180 bottom
C24  8.38,45.21 270 bottom
C26  12.45,49.66 90 bottom
D1  25.53,21.08 90 bottom
D2  33.91,43.05 270 bottom
FRAME1  15.88,-13.97 0 top  (outside the outline)
H1  4.93,52.55 0 top
H2  30.33,4.95 0 top
IC2  29.84,39.37 180 bottom
J1  4.7,28.96 180 top
J3  4.7,44.07 180 top
J4  28.96,32.13 270 bottom
JP1  18.29,44.45 0 bottom
JP2  26.67,41.91 0 bottom
JP3  31.62,11.3 90 top
L2  9.53,26.16 90 bottom
L4  11.68,44.45 180 bottom
Q1  27.81,26.42 90 bottom
R1  26.92,29.59 90 bottom
R2  27.18,34.54 270 bottom
R3  1.78,37.34 180 bottom
R4  22.23,13.08 0 bottom
R5  22.23,14.48 0 bottom
R6  1.78,35.81 0 bottom
R12  32.13,43.05 270 bottom
R13  25.53,25.02 270 bottom
R20  17.14,51.44 0 bottom
R21  19.68,51.44 0 bottom
R22  14.61,51.44 180 bottom
R23  13.46,52.96 180 bottom
R24  11.68,47.24 180 bottom
R25  26.92,39.12 270 bottom
R26  10.92,49.66 270 bottom
R27  9.4,49.66 90 bottom
R28  19.68,48.39 0 bottom
R29  19.68,49.91 0 bottom
R30  17.14,52.96 0 bottom
SG1  31.24,20.57 270 bottom
U1  5.08,42.55 270 bottom
U2  23.5,39.37 270 bottom
U3  15.88,39.5 270 bottom
U4  10.16,9.53 90 top
U5  3.68,27.81 270 bottom
U6  17.14,28.57 90 bottom
U8  27.94,51.44 0 bottom
U9  15.75,47.88 180 bottom
U10  8.13,18.8 0 bottom
U$2  24.13,17.53 180 bottom
U$3  24.13,6.6 0 top
U$5  [PARA]  19.68,17.14 270 bottom

### Tracks (layer width: path | path; a pad name or v marks a point on that pad's centre or on a via)
!RESET  (via drill 0.3, 0.35)
  Top 0.203: v19.56,24.26 24.13,19.68 v24.13,17.53 23.62,17.02 23.62,13.21 v24,12.83
  Bottom 0.203: U6.52 19.39,23.97 19.56,24.13 v19.56,24.26 | JP3.10 29.97,12.83 v24,12.83 23.06,12.83 | 23.06,12.83 22.99,12.83 | 23.06,12.83 R4.1 | v24.13,17.53 24.78,18.18 U$2.2
BAT_OK  (via drill 0.3)
  Top 0.152: 25.02,41.53 v24.91,41.42
  Top 0.203: v25.02,43.94 25.02,41.53
  Bottom 0.152: 25.4,41.91 JP2.3
  Bottom 0.203: U9.11 17.9,47.63 21.59,43.94 v25.02,43.94 | v24.91,41.42 25.4,41.91
BUTTON  (1 unrouted)
  Bottom 0.203: U6.51 19.89,21.89 20.19,21.59 21.08,21.59 22.61,20.07 22.61,18.03 24.04,16.6 U$2.3 24.13,15.8 R5.1 22.8,14.85 | 24.34,16.39 26.26,16.39 U$3.P$2
BUZZER
  Bottom 0.203: U6.49 21.75,22.82 22.48,22.1 24.38,22.1 24.64,22.35 24.64,24.13 24.95,24.44 R13.2
CS_ACCEL
  Bottom 0.203: U6.20 14.89,35.4 14.48,35.81 10.41,35.81 9.53,36.7 9.53,39.37 7.49,41.4 7.49,44.96 6.99,45.47 5.46,45.47 5.08,45.09 U1.7
CS_BARO
  Bottom 0.203: U5.3 4.33,31.89 4.77,32.33 U6.16
CS_MEM
  Bottom 0.203: U6.61 14.89,21.37 14.22,20.7 U10.1
D+
  Bottom 0.203: U6.46 23.92,25.82 24.77,26.67 24.77,29.84 26.29,31.37 28.94,31.37 J4.B6 30.11,31.38 30.23,31.5 30.23,32.26 30.1,32.38 28.96,32.38 J4.A6
D-
  Bottom 0.203: U6.45 23.66,26.32 24.13,26.8 24.13,30.1 26.35,32.32 27.5,32.32 | J4.B7 28.05,32.88 27.5,32.32 | J4.A7 27.94,31.88 27.5,32.32
EN  (via drill 0.3)
  Top 0.203: v18.03,40.51 v18.03,33.02
  Bottom 0.203: U3.3 17.77,40.77 v18.03,40.51 | v18.03,33.02 17.39,33.66 U6.25
GND  (via drill 0.3)
  Bottom 0.203: U9.17 15,48.63 U9.5 | 16.5,47.13 U9.13 | U9.17 16.5,47.13 | 16.5,47.13 U9.12 | U9.17 15,47.13 U9.1 | U9.17 16.13,48.26
  Bottom 0.254: U1.5 4.13,43.56 v5.08,43.56 5.08,43.05 4.97,42.95 U1.4 | U1.2 4.77,41.34 v5.08,41.66
  Bottom 0.406: C5.2 v20.83,42.42 | U2.2 23.5,41.15 v23.75,41.4 23.75,42.08 C2.2 | v28.19,36.2 28.96,35.43 J4.GND | v27.81,28.32 28.4,28.91 J4.GND2
  other vias: 21.84,19.05 19.68,18.03 25.53,21.08 19.43,6.48 13.08,0.76 3.3,3.17 13.84,19.18 2.41,22.23 3.05,28.83 5.46,26.8 4.83,35.31 5.71,34.67 10.03,31.5 8.76,31.5 16.38,29.21 17.91,29.21 17.14,26.29 6.1,37.47 2.79,39.62 1.65,45.72 6.99,47.75 6.86,48.9 6.48,50.67 9.27,48.13 9.65,43.18 18.03,46.23 23.88,38.99 23.5,46.23 20.32,52.58 12.45,51.94 33.66,51.18 29.84,41.4 33.91,40.89 24.64,35.43 23.24,33.02 27.81,27.18 24.26,25.15 16.26,18.29 10.41,37.21 14.61,24.26 18.03,21.84 22.1,49.02 15.88,38.1 20.32,41.53 15.88,33.15 13.84,40.13 20.95,1.27 24.77,4.45 29.84,1.27 28.57,11.43 31.11,20.95 24,44.58 34.29,45.72 1.91,52.7 10.16,53.34 21.46,29.21 16.51,3.81 16.64,16 4.7,33.53 10.41,33.66 7.62,38.23 12.57,27.94 24.38,14.1 20.19,47.37 15.88,39.88 3.94,15.11
  pour Bottom: -5.08,-4.45 -5.08,60.33 40.01,60.33 40.01,-5.08 -4.45,-5.08
  pour Top: -5.08,-5.71 -5.08,60.96 41.27,107.31 41.27,-5.71
GPS_INT  (via drill 0.3)
  Top 0.254: U4.19 2.15,7.62 1.14,8.64 1.14,17.14 8.38,24.38 v10.41,24.38
  Bottom 0.203: U6.3 10.59,25.82 10.41,25.65 v10.41,24.38
LED  (via drill 0.3, 0.35)
  Top 0.203: v32.26,41.02 30.86,41.02 v27.05,37.21
  Bottom 0.203: v27.05,37.21 25.78,35.94 25.78,33.39 23.71,31.32 U6.35 | v32.26,41.02 32.26,42.35 R12.2
N$1
  Bottom 0.203: U9.7 16,50.16 16.57,50.73 R20.2
  Bottom 0.254: R22.2 R20.2 R30.2
N$2
  Bottom 0.254: U9.8 16.55,49.31 17.73,50.49 R20.1 R21.2
N$3  (1 unrouted)
  Bottom 0.254: U9.15 15.5,45.19 15.95,44.72
  Bottom 0.406: JP1.3 C23.2
  Bottom 0.508: C17.2 C23.2
N$4
  Bottom 0.203: J4.B5 27.13,30.38 R1.2
N$5
  Bottom 0.203: J4.A5 27.58,33.38 27.18,33.78 R2.2
N$6
  Bottom 0.152: JP2.2 26.67,42.27
  Bottom 0.203: U2.3 26.3,40.65 26.67,41.02 JP2.2
N$10
  Bottom 0.406: Q1.3 28.96,26.42 30.65,24.72 SG1.- 29.97,24.72 27.99,22.74 26.04,22.74 D1.A
N$13
  Bottom 0.203: R13.1 26.68,25.6 Q1.1
N$14
  Bottom 0.203: 2.71,20.87 2.46,20.87 C18.2
  Bottom 0.406: U10.8 2.88,20.7 2.71,20.87
N$17
  Bottom 0.254: D2.A 33.61,43.63 R12.1
N$18
  Bottom 0.305: R25.2 28.43,38.54 IC2.5
N$19
  Bottom 0.203: U6.53 18.89,20.69 C11.1 C14.1
N$20
  Bottom 0.254: U9.6 15.5,49.78 14.03,51.25 R22.1 14.03,52.96 R23.2
N$21
  Bottom 0.203: R29.2 19.11,50.22 19.56,50.67 20.95,50.67 21.08,50.8 21.08,52.7 20.57,53.21 17.98,53.21 R30.1
  Bottom 0.254: R29.2 18.72,49.53 17.65,49.53 17.18,49.06 U9.9
N$22
  Bottom 0.254: U9.10 18.85,48.13 R28.2 19.43,48.71 19.43,49.02 19.56,49.15 19.94,49.15 20.27,49.48 R29.1
N$23
  Bottom 0.254: U6.8 10.79,28.32 9.94,28.32 C16.1 9.4,28.74
  Bottom 0.406: C16.1 9.53,28.32 | 9.53,28.32 L2.2 | C3.1 9.4,28.74 | 10.79,28.32 9.53,28.32
N$24
  Bottom 0.254: U9.4 12.89,48.63 C26.1
N$25
  Bottom 0.254: R26.2 10.92,48.9 11.68,48.13 | U9.3 11.68,48.13 | R24.1 11.1,47.55 11.68,48.13
N$26  (via drill 0.3)
  Top 0.406: J3.2 3.7,45.45 4.7,44.45 6.22,44.45 7.11,45.34 7.11,45.85 v7.24,45.97
  Bottom 0.254: U9.2 12.64,47.62 R24.2
  Bottom 0.406: v7.24,45.97 7.33,46.06 C24.1 8.57,46.06 L4.P$1 12.26,46.53 R24.2
N$27
  Bottom 0.254: U9.16 14.65,46.1 14.35,46.1
  Bottom 0.406: L4.P$2 13.18,44.93 14.35,46.1
N$29
  Bottom 0.254: R27.2 R26.1
RN4871_MODE  (via drill 0.3)
  Top 0.203: v22.35,52.45 22.86,51.94 22.86,36.83 21.97,35.94 v21.46,35.94
  Bottom 0.203: v22.35,52.45 23.62,52.45 U8.16 | U6.32 21.46,34.89 v21.46,35.94
RN4871_RST  (via drill 0.3)
  Top 0.203: v20.32,35.56 20.83,35.05 21.72,35.05 26.16,39.5 v26.16,44.07
  Bottom 0.203: U6.31 20.39,35.48 v20.32,35.56 | v26.16,44.07 26.14,44.09 U8.10
RSTLCK
  Bottom 0.203: U6.50 20.39,22.02 20.45,21.97 21.34,21.97 23.48,19.83 U$2.1
SENSE_BAT  (via drill 0.3)
  Top 0.203: v5.59,36.07 10.16,36.07 11.43,34.8 11.43,32.38 11.94,31.88 v12.83,31.88
  Bottom 0.203: R6.1 R3.2 3.63,36.07 v5.59,36.07 | v12.83,31.88 12.78,31.82 U6.15
SERCOM0_MISO  (via drill 0.3)
  Top 0.203: v2.03,23.24 2.03,24.51 7.11,29.59 7.11,32.89 7.75,33.53 9.14,33.53 9.27,33.66 v9.27,35.31
  Bottom 0.203: U5.8 1.78,23.49 v2.03,23.24 | U1.12 6.51,41.05 6.88,41.05 9.02,38.92 9.02,36.32 9.65,35.69 | U6.19 14.39,34.79 13.88,35.31 10.03,35.31 9.65,35.69 | v9.27,35.31 9.65,35.69
SERCOM0_MOSI  (via drill 0.3)
  Top 0.203: v3.3,27.18 3.94,27.18 6.6,29.84 6.6,33.4 7.37,34.16 v8.38,34.16
  Bottom 0.203: U5.7 3.3,25.41 v3.3,27.18 | U1.13 6.6,40.55 8.51,38.63 8.51,35.05 9.24,34.33 | v8.38,34.16 8.51,34.29 9.14,34.29 9.11,34.33 9.24,34.33 | U6.17 9.24,34.33
SERCOM0_SCK
  Bottom 0.203: U5.1 2.08,30.78 2.08,31.59 3.25,32.77 6.99,32.77 | U6.18 13.89,33.71 12.95,32.77 6.99,32.77 | 6.99,32.77 6.86,32.89 6.86,39.5 6.73,39.62 5.33,39.62 5.08,39.88 U1.14
SERCOM1_RX  (via drill 0.3)
  Top 0.203: U4.13 10.16,18.8 13.34,21.97 v13.34,25.53
  Bottom 0.203: U6.2 11.99,25.32 12.45,25.78 13.08,25.78 v13.34,25.53
SERCOM1_TX  (via drill 0.3)
  Top 0.203: U4.14 8,16.91 8,18.16 10.16,20.32 10.41,20.57 12.57,22.73 v12.57,24.89
  Bottom 0.203: v12.57,24.89 12.51,24.82 U6.1
SERCOM2_RX  (via drill 0.3)
  Top 0.203: v20.19,33.27 20.45,33.27 28.57,41.4 v28.57,44.2
  Bottom 0.203: v28.57,44.2 28.57,45.9 U8.8 | U6.30 19.89,33.57 v20.19,33.27
SERCOM2_TX  (via drill 0.3)
  Top 0.203: v19.68,32.64 20.57,32.64 29.21,41.27 29.21,43.56 v29.84,44.2
  Bottom 0.203: U6.29 19.39,32.67 19.43,32.64 v19.68,32.64 | v29.84,44.2 29.84,45.83 U8.7
SERCOM3_RX  (via drill 0.3)
  Top 0.203: JP3.6 28.32,13.97 28.32,23.24 24.77,26.8 v21.59,26.8
  Bottom 0.203: U6.44 21.62,26.82 v21.59,26.8
SERCOM3_TX  (via drill 0.35)
  Top 0.203: JP3.8 29.08,14.48 29.08,23.5 24.38,28.19 v21.46,28.19
  Bottom 0.203: v21.46,28.19 21.46,28.07 22.2,27.32 U6.43
SERCOM5_MISO
  Bottom 0.203: U6.62 14.39,21.76 14.1,21.46 10.67,21.46 10.41,21.21 10.41,19.68 10.67,19.43 U10.2
SERCOM5_MOSI
  Bottom 0.203: U6.63 13.89,22.02 13.84,21.97 6.86,21.97 6.1,21.21 6.1,18.75 U10.5
SERCOM5_SCK
  Bottom 0.203: U6.64 7.08,22.82 5.59,21.34 5.59,19.52 U10.6
SWCLK  (via drill 0.3)
  Top 0.203: JP3.4 30.61,9.65 26.16,9.65 17.02,18.8 17.02,24 v17.4,24.38
  Bottom 0.203: v17.4,24.38 16.89,23.88 U6.57
SWDIO  (via drill 0.3)
  Top 0.203: JP3.2 26.54,8.76 16.38,18.92 v16.38,24.38
  Bottom 0.203: U6.58 16.39,24.37 v16.38,24.38
V_BAT  (via drill 0.3)
  Top 0.203: v1.4,34.67 1.68,34.67 J1.2
  Top 0.406: 3.7,32.89 J1.2 3.83,32.78 3.83,35.96 4.7,36.83 7.62,36.83 12.06,41.27 | v16.08,45.47 16.08,44.65 15.44,44.65 12.06,41.27 | 12.06,41.27 12.08,41.27
  Bottom 0.203: R6.2 1.4,35.62 v1.4,34.67
  Bottom 0.254: U9.14 16,45.55 v16.08,45.47
  Bottom 0.406: v16.08,45.47 19.05,45.47 19.3,45.21 JP1.1
VBUS
  Bottom 0.406: IC2.1 28.89,39.94 29.46,39.37 29.97,39.37 30.8,38.55 IC2.4 31.83,37.03 31.88,37.03 31.88,34.04 | J4.VBUS1 29.81,34.58 30.35,34.04 31.88,34.04 | J4.VBUS2 29.81,29.68 30.48,30.35 31.5,30.35 31.88,30.73 31.88,34.04
VCC-ISO
  Bottom 0.203: U6.56 17.39,20.79 C15.1 18.03,19.9 18.03,18.26 21.64,14.65 R5.2 R4.2 21.64,12.64 26.42,7.87 32,7.87 32.26,8.13 JP3.1
  Bottom 0.254: U6.21 15.39,35.08 15.49,35.18 | U6.56 17.39,23.49 18.16,24.26 | U6.48 22.13,24.82 22.07,24.77 22.23,24.77 | U6.34 21.77,31.82
  Bottom 0.406: 15.49,35.18 16,35.69 18.67,35.69 C7.1 21.08,38.09 U2.5 22.55,36.8 C6.1 22.77,33.82 21.72,32.77 21.72,31.88 21.77,31.82 20.32,30.38 20.32,25.65 | 20.32,25.65 21.21,24.77 22.23,24.77 22.23,24.22 C12.1 | 20.32,25.65 19.56,25.65 | 18.16,24.26 19.56,25.65 | L2.1 9.53,24.13 10.16,23.5 12.57,23.5 14.73,25.65 19.56,25.65
VCC_1  (via drill 0.3, 0.35)  (1 unrouted)
  Top 0.406: v13.97,38.1 17.14,34.92 17.14,27.94 | v27.18,14.22 27.05,14.1 25.4,15.75 25.4,19.68 17.14,27.94 | 17.14,27.94 17.14,27.69 16.64,27.18 | 16.64,27.18 15.49,26.04 15.49,14.73 15.43,14.67 | U4.17 4.69,11.43 4.95,11.68 4.95,14.35 5.4,14.8 15.3,14.8 15.43,14.67 | 15.43,14.67 15.43,5.14 14.61,4.32 10.29,4.32 | 10.29,4.32 8.26,4.32 U4.2 | U4.3 10.16,4.19 10.29,4.32 | v6.86,25.02 6.99,25.15 9.78,25.15 11.81,27.18 16.64,27.18 | v3.94,39.5 4.06,39.5 4.7,40.13 v9.78,40.13 | v18.8,39.62 18.8,44.83 v20.57,46.61
  Bottom 0.406: C4.1 14.93,36.93 U3.5 14.98,38.22 15.75,38.99 18.16,38.99 v18.8,39.62 | C4.1 14.52,37.34 C22.1 9.78,40 v9.78,40.13 | C4.1 13.97,37.88 v13.97,38.1 | v27.18,14.22 C1.1 30.65,16.42 SG1.+ 31.24,16.45 27.75,19.94 25.54,19.94 D1.C | v6.86,25.02 5.7,25.02 U5.5 5.58,23.15 C9.1 5.08,22.64 5.08,20.19 4.32,19.43 U10.7 2.88,19.43 | 2.71,19.26 2.46,19.26 C18.1 2.54,19.09 2.54,17.02 3.43,16.13 9.91,16.13 11.94,18.16 U10.3 | C13.1 4.23,39.2 v3.94,39.5 U1.1 3.27,40.55 2.92,40.89 2.92,41.27 | 2.92,41.27 2.92,44.45 3.02,44.55 U1.6 3.94,46.19 C10.1 | v20.57,46.61 21.38,46.61 C8.1 21.08,47.59 21.08,49.4 21.66,49.98 U8.14 | 2.92,41.27 2.8,41.4 C19.+
VIN  (1 unrouted)
  Bottom 0.203: JP2.1 27.69,43.31
  Bottom 0.406: IC2.3 30.67,40.8 30.67,41.85 29.21,43.31 27.69,43.31 22.9,43.31 22.39,42.8 C2.1 | U2.1 22.55,42.26 C2.1 | C2.1 22.39,43.05 22.14,43.31 18.45,43.31 | JP1.2 18.41,44.32 18.41,43.31
  Bottom 0.508: U3.1 14.93,41.59 15.24,41.91 17.06,41.91 C5.1 18.41,43.27 18.41,43.31

### Text on the board
tNames: ParaBeep! | SOL | BAT
bNames: V0.35B